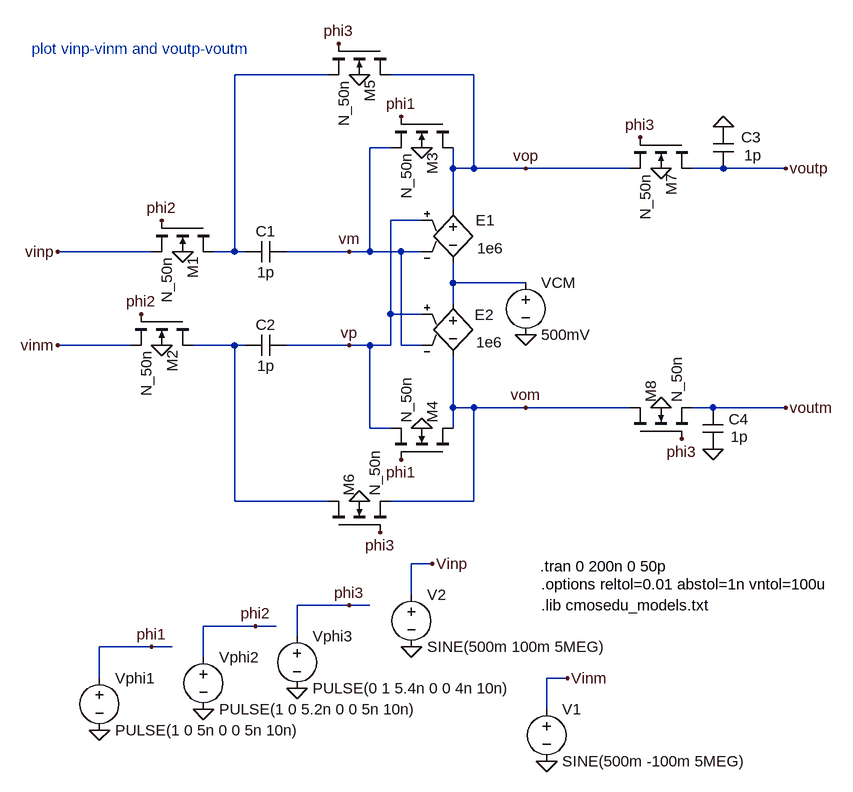
[diagram p0: schematic Fig25_20.asc]
Fig25_20.asc, the LTspice schematic file:
Version 4
SHEET 1 3580 680
WIRE 2400 368 2400 320
WIRE 2448 -144 2336 -144
WIRE 2480 -288 2336 -288
WIRE 2480 320 2400 320
WIRE 2512 320 2480 320
WIRE 2560 336 2560 288
WIRE 2608 -288 2576 -288
WIRE 2608 -288 2608 -560
WIRE 2608 -144 2544 -144
WIRE 2608 96 2608 -144
WIRE 2624 -288 2608 -288
WIRE 2624 -144 2608 -144
WIRE 2640 288 2560 288
WIRE 2672 288 2640 288
WIRE 2704 304 2704 256
WIRE 2752 -560 2608 -560
WIRE 2752 96 2608 96
WIRE 2784 -288 2688 -288
WIRE 2784 -144 2688 -144
WIRE 2784 256 2704 256
WIRE 2816 -288 2784 -288
WIRE 2816 -288 2816 -448
WIRE 2816 -144 2784 -144
WIRE 2816 -16 2816 -144
WIRE 2816 256 2784 256
WIRE 2848 -448 2816 -448
WIRE 2848 -192 2848 -336
WIRE 2848 -144 2816 -144
WIRE 2848 -144 2848 -192
WIRE 2848 -16 2816 -16
WIRE 2864 -288 2816 -288
WIRE 2864 -144 2864 -288
WIRE 2880 240 2880 192
WIRE 2896 -336 2848 -336
WIRE 2896 -288 2864 -288
WIRE 2896 -192 2848 -192
WIRE 2896 -144 2864 -144
WIRE 2912 192 2880 192
WIRE 2944 -416 2944 -448
WIRE 2944 -352 2944 -416
WIRE 2944 -240 2944 -272
WIRE 2944 -208 2944 -240
WIRE 2944 -48 2944 -128
WIRE 2944 -16 2944 -48
WIRE 2976 -560 2848 -560
WIRE 2976 -416 2944 -416
WIRE 2976 -416 2976 -560
WIRE 2976 -48 2944 -48
WIRE 2976 96 2848 96
WIRE 2976 96 2976 -48
WIRE 3056 -416 2976 -416
WIRE 3056 -240 2944 -240
WIRE 3056 -48 2976 -48
WIRE 3088 416 3088 368
WIRE 3120 368 3088 368
WIRE 3216 -416 3056 -416
WIRE 3216 -48 3056 -48
WIRE 3344 -48 3312 -48
WIRE 3360 -416 3312 -416
WIRE 3456 -416 3360 -416
WIRE 3456 -48 3344 -48
FLAG 2400 448 0
FLAG 2480 320 phi1
FLAG 2560 416 0
FLAG 2640 288 phi2
FLAG 2704 384 0
FLAG 2784 256 phi3
FLAG 3088 496 0
FLAG 3120 368 Vinm
FLAG 2880 320 0
FLAG 2912 192 Vinp
FLAG 3056 -160 0
FLAG 2784 -288 vm
FLAG 2784 -144 vp
FLAG 3056 -416 vop
FLAG 3056 -48 vom
FLAG 3344 16 0
FLAG 2528 -288 0
FLAG 2496 -336 phi2
FLAG 2496 -144 0
FLAG 2464 -192 phi2
FLAG 2336 -288 vinp
FLAG 2336 -144 vinm
FLAG 2896 -448 0
FLAG 2864 -496 phi1
FLAG 2896 -16 0
FLAG 2864 32 phi1
FLAG 2800 -560 0
FLAG 2768 -608 phi3
FLAG 2800 96 0
FLAG 2832 144 phi3
FLAG 3264 -416 0
FLAG 3232 -464 phi3
FLAG 3264 -48 0
FLAG 3296 0 phi3
FLAG 3360 -480 0
FLAG 3456 -416 voutp
FLAG 3456 -48 voutm
SYMBOL voltage 2400 352 R0
WINDOW 123 0 0 Left 0
WINDOW 39 0 0 Left 0
SYMATTR InstName Vphi1
SYMATTR Value PULSE(1 0 5n 0 0 5n 10n)
SYMBOL voltage 2560 320 R0
WINDOW 123 0 0 Left 0
WINDOW 39 0 0 Left 0
SYMATTR InstName Vphi2
SYMATTR Value PULSE(1 0 5.2n 0 0 5n 10n)
SYMBOL voltage 2704 288 R0
WINDOW 123 0 0 Left 0
WINDOW 39 0 0 Left 0
SYMATTR InstName Vphi3
SYMATTR Value PULSE(0 1 5.4n 0 0 4n 10n)
SYMBOL voltage 3088 400 R0
WINDOW 123 0 0 Left 0
WINDOW 39 0 0 Left 0
SYMATTR InstName V1
SYMATTR Value SINE(500m -100m 5MEG)
SYMBOL voltage 2880 224 R0
WINDOW 123 0 0 Left 0
WINDOW 39 0 0 Left 0
SYMATTR InstName V2
SYMATTR Value SINE(500m 100m 5MEG)
SYMBOL e 2944 -368 R0
WINDOW 0 35 32 Left 0
WINDOW 3 37 75 Left 0
SYMATTR InstName E1
SYMATTR Value 1e6
SYMBOL e 2944 -224 R0
WINDOW 0 33 33 Left 0
WINDOW 3 36 75 Left 0
SYMATTR InstName E2
SYMATTR Value 1e6
SYMBOL voltage 3056 -256 R0
SYMATTR InstName VCM
SYMATTR Value 500mV
SYMBOL cap 2688 -272 M270
WINDOW 0 32 32 VTop 0
WINDOW 3 0 32 VBottom 0
SYMATTR InstName C1
SYMATTR Value 1p
SYMBOL cap 2688 -128 M270
WINDOW 0 32 32 VTop 0
WINDOW 3 0 32 VBottom 0
SYMATTR InstName C2
SYMATTR Value 1p
SYMBOL cap 3376 -416 R180
WINDOW 0 -42 48 Left 0
WINDOW 3 -43 20 Left 0
SYMATTR InstName C3
SYMATTR Value 1p
SYMBOL cap 3328 -48 R0
WINDOW 0 40 18 Left 0
WINDOW 3 43 45 Left 0
SYMATTR InstName C4
SYMATTR Value 1p
SYMBOL nmos4 2576 -336 R90
SYMATTR InstName M1
SYMATTR Value N_50n
SYMATTR Value2 l=50n w=500n
SYMBOL nmos4 2544 -192 R90
SYMATTR InstName M2
SYMATTR Value N_50n
SYMATTR Value2 l=50n w=500n
SYMBOL nmos4 2944 -496 R90
SYMATTR InstName M3
SYMATTR Value N_50n
SYMATTR Value2 l=50n w=500n
SYMBOL nmos4 2944 32 M270
SYMATTR InstName M4
SYMATTR Value N_50n
SYMATTR Value2 l=50n w=500n
SYMBOL nmos4 2848 -608 R90
SYMATTR InstName M5
SYMATTR Value N_50n
SYMATTR Value2 l=50n w=500n
SYMBOL nmos4 2752 144 R270
SYMATTR InstName M6
SYMATTR Value N_50n
SYMATTR Value2 l=50n w=500n
SYMBOL nmos4 3312 -464 R90
SYMATTR InstName M7
SYMATTR Value N_50n
SYMATTR Value2 l=50n w=500n
SYMBOL nmos4 3216 0 R270
SYMATTR InstName M8
SYMATTR Value N_50n
SYMATTR Value2 l=50n w=500n
TEXT 3080 256 Left 0 !.lib cmosedu_models.txt
TEXT 2296 -600 Left 0 ;plot vinp-vinm and voutp-voutm
TEXT 3078 196 Left 0 !.tran 0 200n 0 50p
TEXT 3080 224 Left 0 !.options reltol=0.01 abstol=1n vntol=100u

The netlist it stands for:
* Fig25_20.asc
Vphi1 phi1 0 PULSE(1 0 5n 0 0 5n 10n)
Vphi2 phi2 0 PULSE(1 0 5.2n 0 0 5n 10n)
Vphi3 phi3 0 PULSE(0 1 5.4n 0 0 4n 10n)
V1 Vinm 0 SINE(500m -100m 5MEG)
V2 Vinp 0 SINE(500m 100m 5MEG)
E1 vop N003 vp vm 1e6
E2 N003 vom vp vm 1e6
VCM N003 0 500mV
C1 vm N001 1p
C2 vp N002 1p
C3 voutp 0 1p
C4 voutm 0 1p
M1 N001 phi2 Vinp 0 N_50n l=50n w=500n
M2 N002 phi2 Vinm 0 N_50n l=50n w=500n
M3 vop phi1 vm 0 N_50n l=50n w=500n
M4 vom phi1 vp 0 N_50n l=50n w=500n
M5 vop phi3 N001 0 N_50n l=50n w=500n
M6 N002 phi3 vom 0 N_50n l=50n w=500n
M7 voutp phi3 vop 0 N_50n l=50n w=500n
M8 vom phi3 voutm 0 N_50n l=50n w=500n
.model NMOS NMOS
.model PMOS PMOS
.lib standard.mos
.lib cmosedu_models.txt
* plot vinp-vinm and voutp-voutm
.tran 0 200n 0 50p
.options reltol=0.01 abstol=1n vntol=100u
.backanno
.end